# Altium schematic sheet GR_Stepper_Driver.SchDoc
size A4
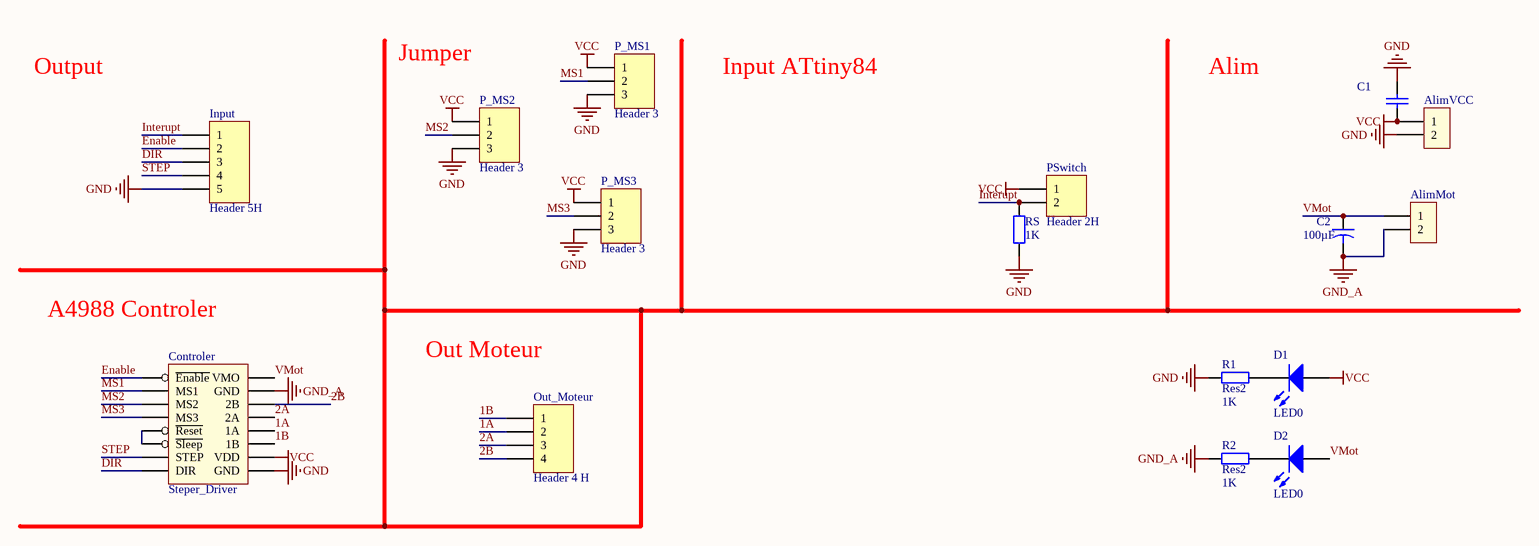
[diagram p0: GR_Stepper_Driver.SchDoc]

## Parts
AlimMot  AlimMot  [Molex_MiniFitJr_2x1H]  (value not drawn)
AlimVCC  AlimVCC  [Molex_MiniFitJr_2x1H]  (value not drawn)
C1  Cap  [3.2X1.6X1.1]  (value not drawn)
C2  value 100µF  [Condensateur]  (hidden comment: Cap2)
Controler  Steper_Driver  [A4988_module]
D1  LED0  [3.2X1.6X1.1]
D2  LED0  [3.2X1.6X1.1]
Input  Header 5H  [MOLEX SPOX 5X1H]
Out_Moteur  Header 4 H  [Molex SPOX 4x1H]
P_MS1  Header 3  [HDR1X3]
P_MS2  Header 3  [HDR1X3]
P_MS3  Header 3  [HDR1X3]
PSwitch  Header 2H  [Molex SPOX 2x1H]
R1  Res2  value 1K  [3.2X1.6X1.1]
R2  Res2  value 1K  [3.2X1.6X1.1]
RS  value 1K  [3.2X1.6X1.1]  (hidden comment: Res2)

## Nets
GND: AlimVCC.2 C1.1 Controler.9(GND) Input.5 P_MS1.3 P_MS2.3 P_MS3.3 R1.1 RS.1
GND_A: AlimMot.2 C2.2 Controler.15(GND) R2.1
VCC: AlimVCC.1 C1.2 Controler.10(VDD) D1.1(A) P_MS1.1 P_MS2.1 P_MS3.1 PSwitch.1
1A: Controler.12(1A) Out_Moteur.2
1B: Controler.11(1B) Out_Moteur.1
2A: Controler.13(2A) Out_Moteur.3
2B: Controler.14(2B) Out_Moteur.4
DIR: Controler.8(DIR) Input.3
Enable: Controler.1(~{Enable}) Input.2
Interupt: Input.1 PSwitch.2 RS.2
MS1: Controler.2(MS1) P_MS1.2
MS2: Controler.3(MS2) P_MS2.2
MS3: Controler.4(MS3) P_MS3.2
STEP: Controler.7(STEP) Input.4
VMot: AlimMot.1 C2.1 Controler.16(VMO) D2.1(A)
NetControler_5: Controler.5(~{Reset}) Controler.6(~{Sleep})
NetD1_2: D1.2(K) R1.2
NetD2_2: D2.2(K) R2.2

## Notes on the sheet
- Labels drawn without touching a wire or pin: A4988 Controler, Alim, Input ATtiny84, Jumper, Out Moteur, Output

## Library data of the parts
AlimMot AlimVCC = Molex_minifit_2
C1 = Cap: Capacitor; Value: 100pF; Published: 8-Jun-2000; LatestRevisionDate: 17-Jul-2002; LatestRevisionNote: Re-released for DXP Platform.; PackageReference: RAD-0.3; Publisher: Altium Limited; PackageDescription: Radial Cap, Thru-Hole; 2 Leads; 0.3 in Pin Spacing
C2 = Cap2: Capacitor; Published: 23-Sep-2002; PackageReference: CAPR5-4X5; Publisher: Altium Limited; PackageDescription: Capacitor; 2 Leads
Controler = Steper_Driver: A4988
D1 D2 = LED0: Typical INFRARED GaAs LED; Published: 8-Jun-2000; LatestRevisionDate: 08-Jul-2005; LatestRevisionNote: Mech Layer 1 removed.; PackageReference: LED-0; Publisher: Altium Limited; PackageDescription: LED; 2 Leads
Input = Header 5H: Header, 5-Pin, Right Angle; LatestRevisionDate: 17-Jul-2002; LatestRevisionNote: Re-released for DXP Platform.; Publisher: Altium Limited
Out_Moteur = Header 4: Header, 4-Pin; LatestRevisionDate: 17-Jul-2002; LatestRevisionNote: Re-released for DXP Platform.; Publisher: Altium Limited
P_MS1-P_MS3 = Header 3: Header, 3-Pin; LatestRevisionDate: 17-Jul-2002; LatestRevisionNote: Re-released for DXP Platform.; Publisher: Altium Limited
PSwitch = Header 2H: Header, 2-Pin, Right Angle; pin to pad: 1>2 2>1; LatestRevisionDate: 17-Jul-2002; LatestRevisionNote: Re-released for DXP Platform.; Publisher: Altium Limited
R1 R2 RS = Res2: Resistor; Published: 8-Jun-2000; LatestRevisionDate: 17-Jul-2002; LatestRevisionNote: Re-released for DXP Platform.; PackageReference: AXIAL-0.4; Publisher: Altium Limited; PackageDescription: Axial Device, Thru-Hole; 2 Leads; 0.4 in Pin Spacing